# Altium schematic sheet TP_IHM_7SEG.SchDoc
size A4
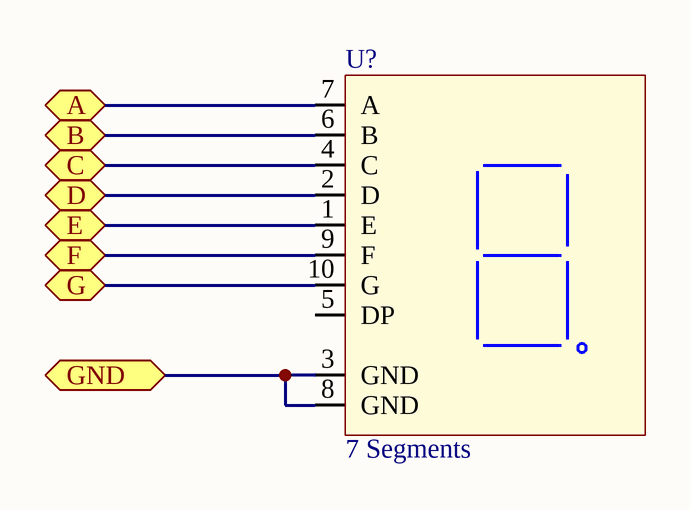
[diagram p0: TP_IHM_7SEG.SchDoc]

## Parts
U?  7 Segments  [SA10-21GWA]

## Ports
A, B, C, D, E, F, G, GND

## Nets
A: U?.7(A) ; port A
B: U?.6(B) ; port B
C: U?.4(C) ; port C
D: U?.2(D) ; port D
E: U?.1(E) ; port E
F: U?.9(F) ; port F
G: U?.10(G) ; port G
GND: U?.3(GND) U?.8(GND) ; port GND

Not connected (* = marked no-connect by the designer): U? 5(DP)

## Library data of the parts
U? = SC10-21SRWA: KingBright Led 7 Segments; Reference: SC10-21SRWA